# Altium schematic sheet ALU.SchDoc: ALU
size A4; Author: Ben Eater; DrawnBy: LittleYe233; SheetNumber: 5; SheetTotal: 6
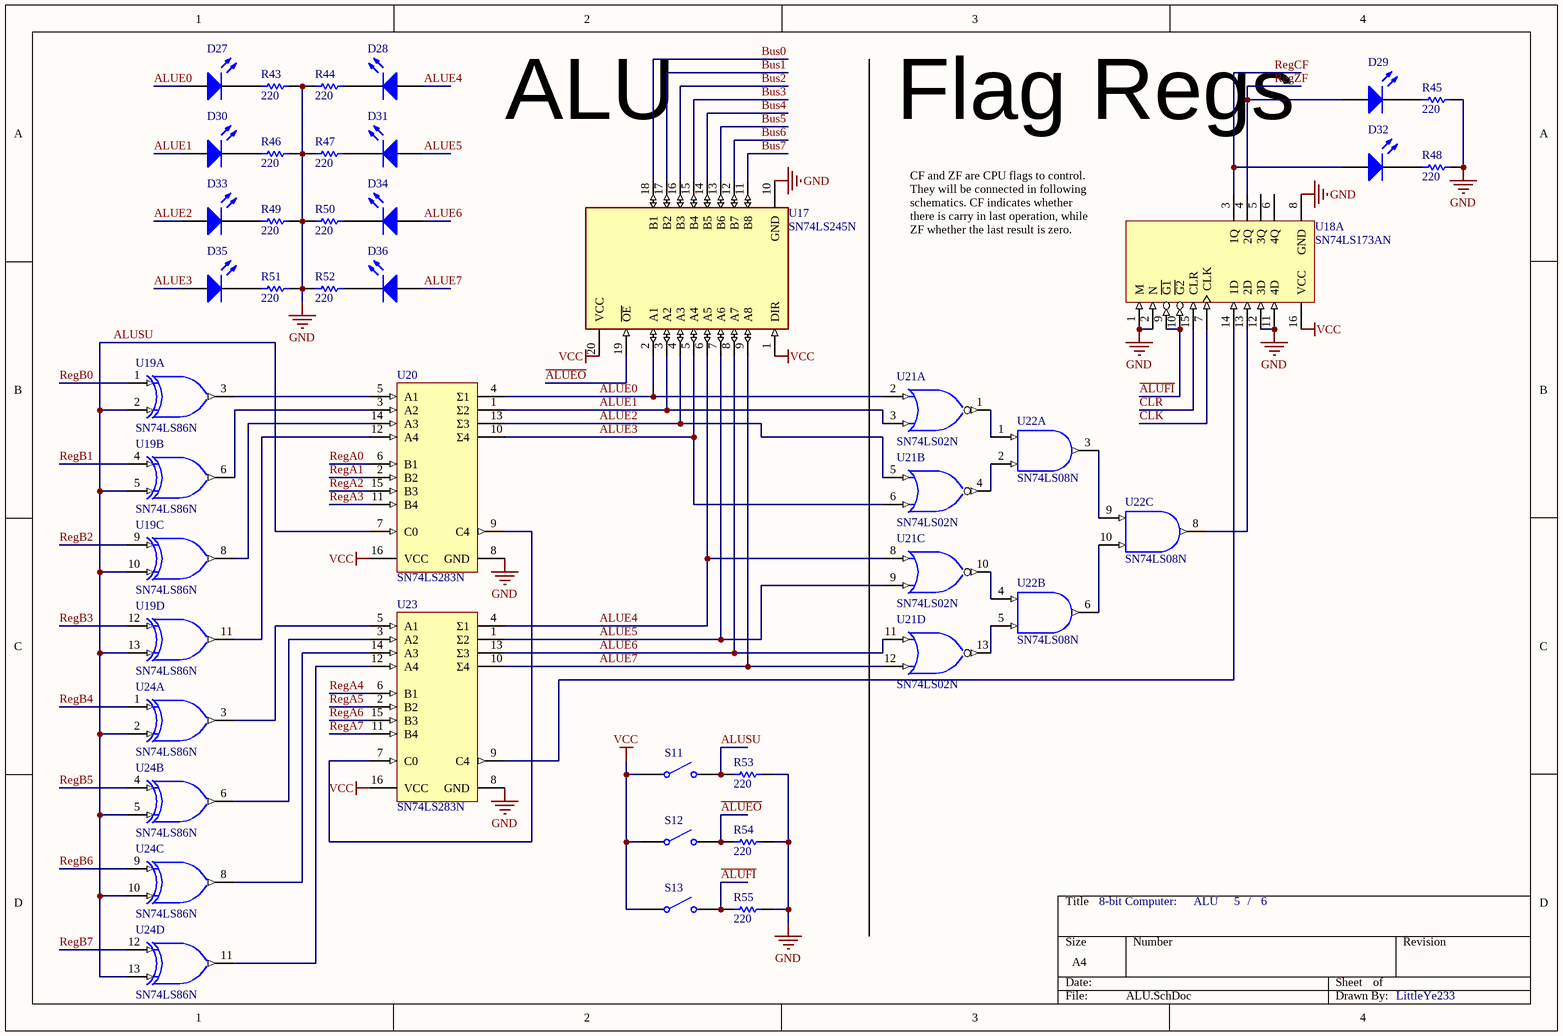
[diagram p0: ALU.SchDoc]

## Parts
D27  Light-Emitting Diode  (value not drawn)
D28  Light-Emitting Diode  (value not drawn)
D29  Light-Emitting Diode  (value not drawn)
D30  Light-Emitting Diode  (value not drawn)
D31  Light-Emitting Diode  (value not drawn)
D32  Light-Emitting Diode  (value not drawn)
D33  Light-Emitting Diode  (value not drawn)
D34  Light-Emitting Diode  (value not drawn)
D35  Light-Emitting Diode  (value not drawn)
D36  Light-Emitting Diode  (value not drawn)
R43  value 220  (hidden comment: Resistor)
R44  value 220  (hidden comment: Resistor)
R45  value 220  (hidden comment: Resistor)
R46  value 220  (hidden comment: Resistor)
R47  value 220  (hidden comment: Resistor)
R48  value 220  (hidden comment: Resistor)
R49  value 220  (hidden comment: Resistor)
R50  value 220  (hidden comment: Resistor)
R51  value 220  (hidden comment: Resistor)
R52  value 220  (hidden comment: Resistor)
R53  value 220  (hidden comment: Resistor)
R54  value 220  (hidden comment: Resistor)
R55  value 220  (hidden comment: Resistor)
S11  Single-Pole, Single-Throw Switch  (value not drawn)
S12  Single-Pole, Single-Throw Switch  (value not drawn)
S13  Single-Pole, Single-Throw Switch  (value not drawn)
U17  SN74LS245N  [FP-N0020A-MFG]
U18  SN74LS173AN  [N0016A]  (part A of 2)
U19  SN74LS86N  (parts A,B,C,D of 5)
U20  SN74LS283N  [N0016A]
U21  SN74LS02N  [N0014A]  (parts A,B,C,D of 5)
U22  SN74LS08N  [N0014A]  (parts A,B,C of 5)
U23  SN74LS283N  [N0016A]
U24  SN74LS86N  (parts A,B,C,D of 5)

## Nets
GND: R43.2 R44.1 R45.2 R46.2 R47.1 R48.2 R49.2 R50.1 R51.2 R52.1 R53.1 R54.1 R55.1 U17.10(GND) U18.1(M) U18.2(N) U18.8(GND) U18.11(4D) U18.12(3D) U20.8(GND) U23.8(GND)
VCC: S11.1 S12.1 S13.1 U17.1(DIR) U17.20(VCC) U18.16(VCC) U20.16(VCC) U23.16(VCC)
~{ALUEO}: R54.2 S12.2 U17.19(~{OE})
~{ALUFI}: R55.2 S13.2 U18.9(~{G1}) U18.10(~{G2})
ALUE0: D27.1(A) U17.2(A1) U20.4(Σ1) U21.2(1A)
ALUE1: D30.1(A) U17.3(A2) U20.1(Σ2) U21.3(1B)
ALUE2: D33.1(A) U17.4(A3) U20.13(Σ3) U21.5(2A)
ALUE3: D35.1(A) U17.5(A4) U20.10(Σ4) U21.6(2B)
ALUE4: D28.1(A) U17.6(A5) U21.8(3A) U23.4(Σ1)
ALUE5: D31.1(A) U17.7(A6) U21.9(3B) U23.1(Σ2)
ALUE6: D34.1(A) U17.8(A7) U21.11(4A) U23.13(Σ3)
ALUE7: D36.1(A) U17.9(A8) U21.12(4B) U23.10(Σ4)
ALUSU: R53.2 S11.2 U19.2(1B) U19.5(2B) U19.10(3B) U19.13(4B) U20.7(C0) U24.2(1B) U24.5(2B) U24.10(3B) U24.13(4B)
Bus0: U17.18(B1)
Bus1: U17.17(B2)
Bus2: U17.16(B3)
Bus3: U17.15(B4)
Bus4: U17.14(B5)
Bus5: U17.13(B6)
Bus6: U17.12(B7)
Bus7: U17.11(B8)
CLK: U18.7(CLK)
CLR: U18.15(CLR)
RegA0: U20.6(B1)
RegA1: U20.2(B2)
RegA2: U20.15(B3)
RegA3: U20.11(B4)
RegA4: U23.6(B1)
RegA5: U23.2(B2)
RegA6: U23.15(B3)
RegA7: U23.11(B4)
RegB0: U19.1(1A)
RegB1: U19.4(2A)
RegB2: U19.9(3A)
RegB3: U19.12(4A)
RegB4: U24.1(1A)
RegB5: U24.4(2A)
RegB6: U24.9(3A)
RegB7: U24.12(4A)
RegCF: D32.1(A) U18.3(1Q)
RegZF: D29.1(A) U18.4(2Q)
NetD27_2: D27.2(K) R43.1
NetD28_2: D28.2(K) R44.2
NetD29_2: D29.2(K) R45.1
NetD30_2: D30.2(K) R46.1
NetD31_2: D31.2(K) R47.2
NetD32_2: D32.2(K) R48.1
NetD33_2: D33.2(K) R49.1
NetD34_2: D34.2(K) R50.2
NetD35_2: D35.2(K) R51.1
NetD36_2: D36.2(K) R52.2
NetU18_13: U18.13(2D) U22.8(3Y)
NetU18_14: U18.14(1D) U23.9(C4)
NetU19_3: U19.3(1Y) U20.5(A1)
NetU19_6: U19.6(2Y) U20.3(A2)
NetU19_8: U19.8(3Y) U20.14(A3)
NetU19_11: U19.11(4Y) U20.12(A4)
NetU20_9: U20.9(C4) U23.7(C0)
NetU21_1: U21.1(1Y) U22.1(1A)
NetU21_4: U21.4(2Y) U22.2(1B)
NetU21_10: U21.10(3Y) U22.4(2A)
NetU21_13: U21.13(4Y) U22.5(2B)
NetU22_3: U22.3(1Y) U22.9(3A)
NetU22_6: U22.6(2Y) U22.10(3B)
NetU23_3: U23.3(A2) U24.6(2Y)
NetU23_5: U23.5(A1) U24.3(1Y)
NetU23_12: U23.12(A4) U24.11(4Y)
NetU23_14: U23.14(A3) U24.8(3Y)

Not connected (* = marked no-connect by the designer): U18 5(3Q) 6(4Q)

## Notes on the sheet
- ALU
- Flag Regs
- (near U18) CF and ZF are CPU flags to control. They will be connected in following schematics. CF indicates whether there is carry in last operation, while ZF whether the last result is zero.
- 8-bit Computer:
- /

## Library data of the parts
D27-D36 = LED: AF: 1; BV: 0; BV_MAX: 1e99; EG: 1.11; FC: 0.5; IBV: 0.001; IS: 1e-14; MJSW: 0.33; NTUN: 30; TNOM: 27; XTI: 3; SimulationGenericComponent: True; CJO: 0; CJP: 0; CTA: 0; CTP: 0; FCS: 0.5; FV_MAX: 1e99; IKF: 0; IKR: 0; ISR: 1e-14; JSW: 0; JTUN: 0; JTUNSW: 0; KEG: 1; KF: 0; LEVEL: 1; N: 1; NBV: 1; NR: 1; NS: 1; PHP: 1; RS: 0; TCV: 0; TLEV: 0; TLEVC: 0; TM1: 0; TM2: 0; TPB: 0; TPHP: 0; TRS: 0; TRS2: 0; TT: 0; TTT1: 0; TTT2: 0; VJ: 1; XTITUN: 3
R43-R55 = Resistor: TC1: 0; SimulationGenericComponent: True; TC2: 0
S11-S13 = SPST SW: closed: 0; Rclosed: 1m; Ropen: 1Meg; SimulationGenericComponent: True
U17 = CMP-1620-00419-3: IC TXRX NON-INVERT 5.25V 20DIP; Number of Bits per Element: 8; Polarity: Non-Inverting; Low Level Output Current: 24mA; Propagation Delay: 12ns; Min Supply Voltage: 4.75V; Number of Elements: 1; Quiescent Current: 62mA; Logic Function: Transceiver; Direction: Bidirectional; Operating Supply Voltage: 5V; High Level Output Current: -15mA; Mount: Through Hole; Min Operating Temperature: 0°C; Number of Outputs: 8; Max Operating Temperature: 70°C; Max Supply Voltage: 5.25V; Width: 6.35mm; Number of Pins: 20; RoHS Compliant: Yes; Turn-On Delay Time: 12ns; Termination: Through Hole; Number of Channels: 8; Number of Circuits: 8; Weight: 0.042297oz; Package Quantity: 20; Number of Transceivers: 8; Length: 24.33mm; Height: 4.57mm; REACH SVHC: No SVHC; Contact Plating: Gold; Number of Bits: 8; Lead Free: Lead Free; Case/Package: PDIP; Packaging: Rail/Tube; Radiation Hardening: No
U18 = CMP-1619-00777-2: 4-Bit D-type Registers with 3-State Outputs, N0016A, TUBE; Manufacturer: Texas Instruments; VCC(Max)(V): 5.25; ICC @ Nom Voltage(Max)(mA): 24; F @ Nom Voltage(Max)(Mhz): 35; Bits(#): 4; tpd @ Nom Voltage(Max)(ns): 30; Output Logic: Non-inverted; VCC(Min)(V): 4.75; 3-State Output: Yes; Voltage(Nom)(V): 5; Output Drive (IOL/IOH)(Max)(mA): 24/-2.6; Rating: Catalog; Output: 3S; Input Type: TTL; Technology Family: LS; Schmitt Trigger: No; Operating Temperature Range(C): 0 to 70; DatasheetVersion: SDLS067A; Generic Part Number: SN74LS173A; Output Type: TTL; PackageReference: N0016A; Code_JEDEC: MS-001
U20 U23 = CMP-1623-00518-2: 4-Bit Binary Full Adders With Fast Carry, N0016A, TUBE; Manufacturer: Texas Instruments; VCC(Min)(V): 4.75; Output Type: CMOS; Inputs: 9; Bits(#): 4; F @ Nom Voltage(Max)(Mhz): 35; Voltage(Nom)(V): 5; Rating: Catalog; tpd @ Nom Voltage(Max)(ns): 24; Schmitt Trigger: No; Technology Family: LS; Output Drive (IOL/IOH)(Max)(mA): 8/-0.4; Input Type: TTL; VCC(Max)(V): 5.25; Function: Arithmetic; ICC @ Nom Voltage(Max)(mA): 34; DatasheetVersion: SDLS095A; PackageReference: N0016A; Generic Part Number: SN74LS283; Type: Binary; Code_JEDEC: MS-001; Operating Temperature Range(C): 0 to 70
U21 = CMP-0806-00181-3: Quad 2-input positive-NOR gates, N0014A, TUBE; Manufacturer: Texas Instruments; Output Drive (IOL/IOH)(Max)(mA): 0.4/-8; F @ Nom Voltage(Max)(Mhz): 35; VCC(Max)(V): 5.25; Bits(#): 4; Input Type: TTL; VCC(Min)(V): 4.75; ICC @ Nom Voltage(Max)(mA): 0.027; tpd @ Nom Voltage(Max)(ns): 22; Voltage(Nom)(V): 5; Rating: Catalog; Generic Part Number: SN74LS02; PackageReference: N0014A; Operating Temperature Range(C): 0 to 70; DatasheetVersion: SDLS027; PackageVersion: http://www.ti.com/lit/ml/mpdi002c/mpdi002c.pdf; Output Type: TTL; Code_JEDEC: MS-001
U22 = CMP-0777-00259-3: Quadruple 2-Input Positive-AND Gates, N0014A, TUBE; Manufacturer: Texas Instruments; VCC(Max)(V): 5.25; ICC @ Nom Voltage(Max)(mA): 0.021; VCC(Min)(V): 4.75; tpd @ Nom Voltage(Max)(ns): 25; Rating: Catalog; Output Type: TTL; Bits(#): 4; Schmitt Trigger: No; Voltage(Nom)(V): 5; Technology Family: LS; F @ Nom Voltage(Max)(Mhz): 35; Output Drive (IOL/IOH)(Max)(mA): -0.8/16; PackageReference: N0014A; DatasheetVersion: SDLS033; Input Type: TTL; Operating Temperature Range(C): 0 to 70; Generic Part Number: SN74LS08